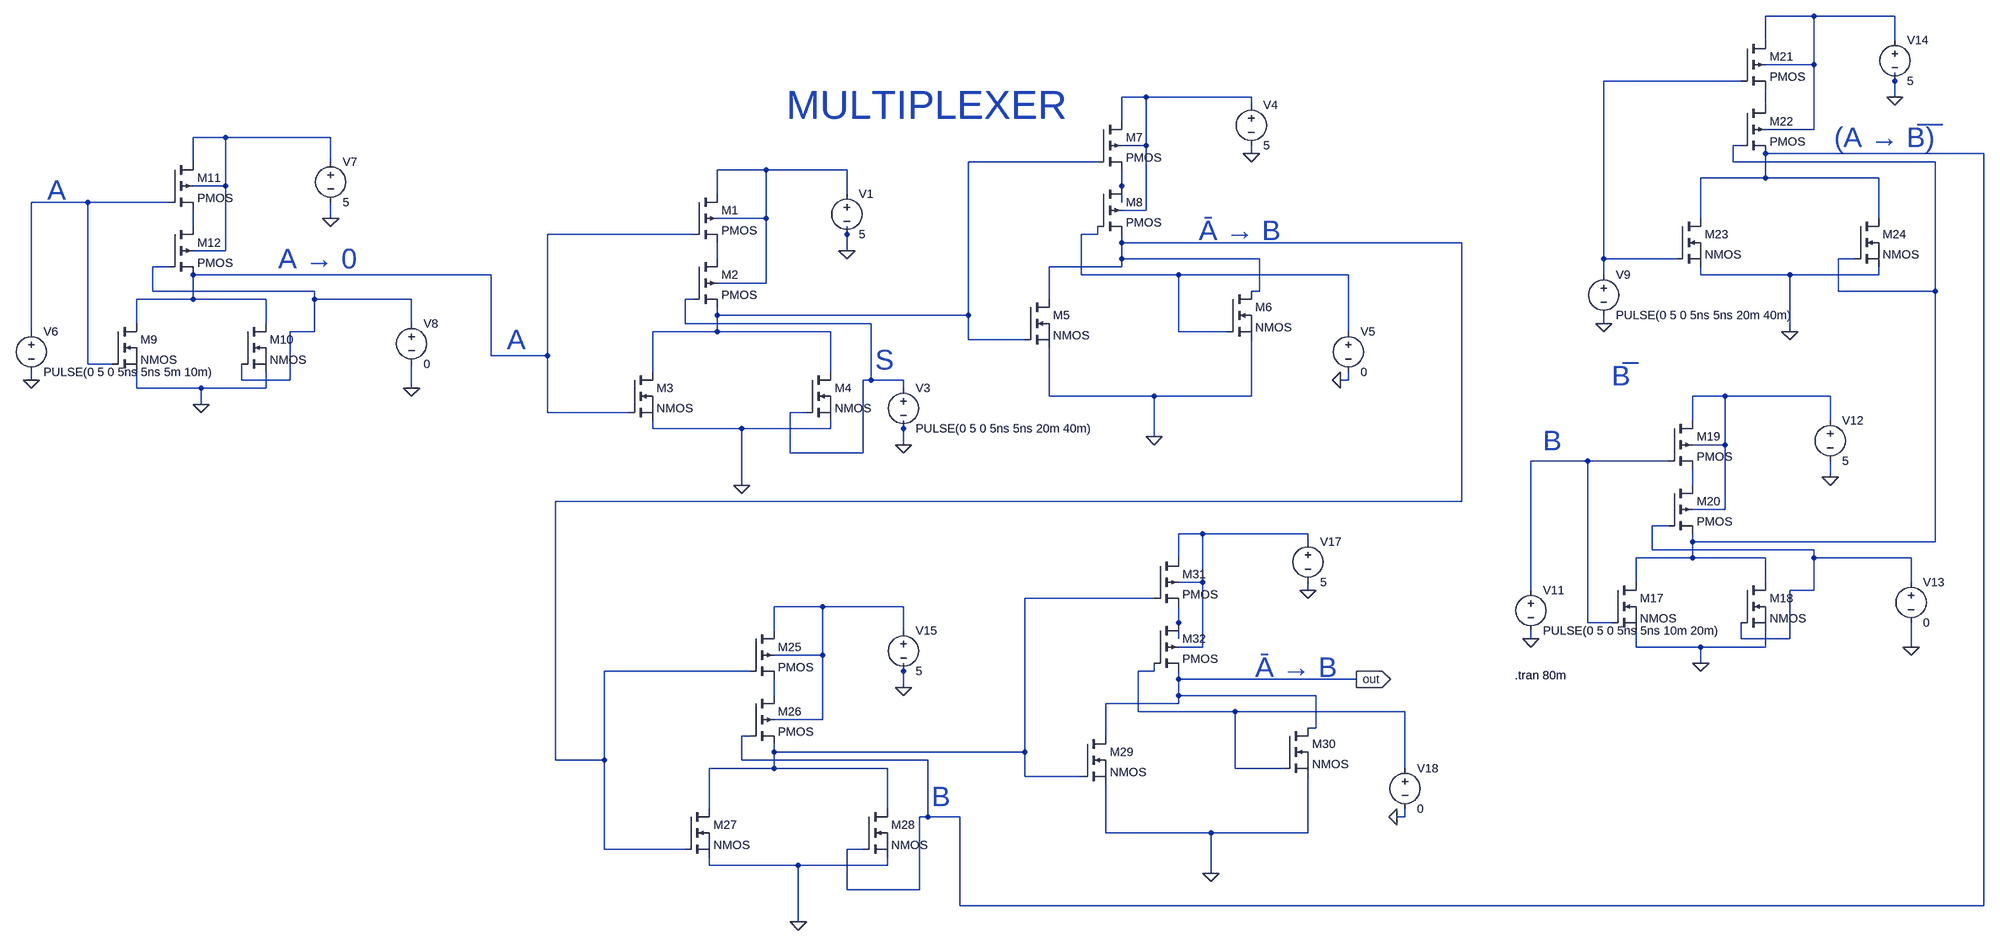
[diagram p0: schematic originalmuximply.asc]
originalmuximply.asc, the LTspice schematic file:
Version 4
SHEET 1 4408 2020
WIRE 3584 -352 3488 -352
WIRE 3744 -352 3584 -352
WIRE 3488 -304 3488 -352
WIRE 3744 -304 3744 -352
WIRE 3584 -256 3584 -352
WIRE 3584 -256 3488 -256
WIRE 3440 -224 3168 -224
WIRE 3744 -224 3744 -240
WIRE 2208 -192 2160 -192
WIRE 2416 -192 2208 -192
WIRE 3744 -192 3744 -224
WIRE 2416 -176 2416 -192
WIRE 3488 -176 3488 -208
WIRE 2160 -144 2160 -192
WIRE 3584 -128 3584 -256
WIRE 3584 -128 3488 -128
WIRE 352 -112 288 -112
WIRE 560 -112 352 -112
WIRE 2208 -96 2208 -192
WIRE 2208 -96 2160 -96
WIRE 3440 -96 3424 -96
WIRE 2416 -80 2416 -96
WIRE 3920 -80 3488 -80
WIRE 288 -64 288 -112
WIRE 560 -64 560 -112
WIRE 2112 -64 1856 -64
WIRE 3424 -64 3424 -96
WIRE 3824 -64 3424 -64
WIRE 1456 -48 1360 -48
WIRE 1616 -48 1456 -48
WIRE 3488 -32 3488 -80
WIRE 3488 -32 3360 -32
WIRE 3712 -32 3488 -32
WIRE 352 -16 352 -112
WIRE 352 -16 288 -16
WIRE 2160 -16 2160 -48
WIRE 1360 0 1360 -48
WIRE 1616 0 1616 -48
WIRE 80 16 -32 16
WIRE 240 16 80 16
WIRE 2160 16 2160 -16
WIRE 2208 32 2208 -96
WIRE 2208 32 2160 32
WIRE 560 48 560 16
WIRE 1456 48 1456 -48
WIRE 1456 48 1360 48
WIRE 3360 48 3360 -32
WIRE 3712 48 3712 -32
WIRE 288 64 288 32
WIRE 1312 80 1024 80
WIRE 1616 80 1616 64
WIRE 2112 80 2112 64
WIRE 2112 80 2080 80
WIRE 2160 96 2160 80
WIRE 2832 96 2160 96
WIRE 352 112 352 -16
WIRE 352 112 288 112
WIRE 1616 112 1616 80
WIRE 1360 128 1360 96
WIRE 2160 128 2160 96
WIRE 2432 128 2160 128
WIRE 3168 128 3168 -224
WIRE 3312 128 3168 128
WIRE 3664 128 3632 128
WIRE 240 144 208 144
WIRE 2160 144 2160 128
WIRE 2160 144 2016 144
WIRE 912 160 288 160
WIRE 2080 160 2080 80
WIRE 2272 160 2080 160
WIRE 2608 160 2272 160
WIRE 3168 160 3168 128
WIRE 3360 160 3360 144
WIRE 3536 160 3360 160
WIRE 3712 160 3712 144
WIRE 3712 160 3536 160
WIRE 1456 176 1456 48
WIRE 1456 176 1360 176
WIRE 208 192 208 144
WIRE 528 192 208 192
WIRE 2432 192 2432 128
WIRE 2432 192 2416 192
WIRE 3632 192 3632 128
WIRE 3824 192 3824 -64
WIRE 3824 192 3632 192
WIRE 288 208 288 160
WIRE 288 208 176 208
WIRE 432 208 288 208
WIRE 528 208 528 192
WIRE 720 208 528 208
WIRE 1312 208 1296 208
WIRE 2016 208 2016 144
WIRE 1360 240 1360 224
WIRE 1856 240 1856 -64
WIRE 1856 240 1360 240
WIRE 176 256 176 208
WIRE 432 256 432 208
WIRE 720 256 720 208
WIRE 1296 256 1296 208
WIRE 1664 256 1296 256
WIRE 3168 256 3168 240
WIRE -32 272 -32 16
WIRE 528 272 528 208
WIRE 528 272 480 272
WIRE 1360 272 1360 240
WIRE 1360 272 1232 272
WIRE 1584 272 1360 272
WIRE 2272 272 2272 160
WIRE 2368 272 2272 272
WIRE 2608 272 2608 160
WIRE 3536 272 3536 160
WIRE 1856 288 1856 240
WIRE 1968 288 1856 288
WIRE 912 320 912 160
WIRE 1024 320 1024 80
WIRE 1024 320 912 320
WIRE 80 336 80 16
WIRE 128 336 80 336
WIRE 1232 352 1232 272
WIRE 1584 352 1584 272
WIRE -32 368 -32 352
WIRE 384 368 384 336
WIRE 480 368 480 272
WIRE 480 368 384 368
WIRE 1664 368 1664 256
WIRE 1664 368 1648 368
WIRE 1728 368 1664 368
WIRE 2608 368 2608 352
WIRE 2608 368 2592 368
WIRE 176 384 176 352
WIRE 304 384 176 384
WIRE 432 384 432 352
WIRE 432 384 304 384
WIRE 720 384 720 336
WIRE 1728 384 1728 368
WIRE 2016 400 2016 304
WIRE 2224 400 2016 400
WIRE 2416 400 2416 288
WIRE 2416 400 2224 400
WIRE 3408 400 3344 400
WIRE 3616 400 3408 400
WIRE 304 416 304 384
WIRE 1024 432 1024 320
WIRE 1184 432 1024 432
WIRE 1536 432 1504 432
WIRE 3344 448 3344 400
WIRE 3616 448 3616 400
WIRE 1232 464 1232 448
WIRE 1408 464 1232 464
WIRE 1584 464 1584 448
WIRE 1584 464 1408 464
WIRE 1728 464 1728 448
WIRE 2224 480 2224 400
WIRE 1728 496 1728 464
WIRE 3408 496 3408 400
WIRE 3408 496 3344 496
WIRE 1504 512 1504 432
WIRE 1648 512 1648 368
WIRE 1648 512 1504 512
WIRE 3136 528 3024 528
WIRE 3296 528 3136 528
WIRE 3616 560 3616 528
WIRE 1408 576 1408 464
WIRE 3344 576 3344 544
WIRE 2832 608 2832 96
WIRE 2832 608 1040 608
WIRE 3408 624 3408 496
WIRE 3408 624 3344 624
WIRE 3296 656 3264 656
WIRE 2320 672 2272 672
WIRE 2528 672 2320 672
WIRE 2528 688 2528 672
WIRE 3344 688 3344 672
WIRE 3824 688 3824 192
WIRE 3824 688 3344 688
WIRE 3264 704 3264 656
WIRE 3584 704 3264 704
WIRE 2272 720 2272 672
WIRE 3344 720 3344 688
WIRE 3344 720 3232 720
WIRE 3488 720 3344 720
WIRE 3584 720 3584 704
WIRE 3776 720 3584 720
WIRE 2320 768 2320 672
WIRE 2320 768 2272 768
WIRE 3232 768 3232 720
WIRE 3488 768 3488 720
WIRE 3776 768 3776 720
WIRE 2528 784 2528 768
WIRE 3024 784 3024 528
WIRE 3584 784 3584 720
WIRE 3584 784 3536 784
WIRE 2224 800 1968 800
WIRE 1568 816 1472 816
WIRE 1728 816 1568 816
WIRE 2272 848 2272 816
WIRE 3136 848 3136 528
WIRE 3184 848 3136 848
WIRE 1472 864 1472 816
WIRE 1728 864 1728 816
WIRE 2272 880 2272 848
WIRE 3024 880 3024 864
WIRE 3440 880 3440 848
WIRE 3536 880 3536 784
WIRE 3536 880 3440 880
WIRE 2320 896 2320 768
WIRE 2320 896 2272 896
WIRE 3232 896 3232 864
WIRE 3360 896 3232 896
WIRE 3488 896 3488 864
WIRE 3488 896 3360 896
WIRE 3776 896 3776 848
WIRE 1568 912 1568 816
WIRE 1568 912 1472 912
WIRE 3360 928 3360 896
WIRE 1424 944 1136 944
WIRE 1728 944 1728 928
WIRE 2224 944 2224 928
WIRE 2224 944 2192 944
WIRE 2272 960 2272 944
WIRE 2624 960 2272 960
WIRE 1728 976 1728 944
WIRE 1472 992 1472 960
WIRE 2272 992 2272 960
WIRE 2544 992 2272 992
WIRE 2272 1008 2272 992
WIRE 2272 1008 2128 1008
WIRE 2192 1024 2192 944
WIRE 2384 1024 2192 1024
WIRE 2720 1024 2384 1024
WIRE 1568 1040 1568 912
WIRE 1568 1040 1472 1040
WIRE 2544 1056 2544 992
WIRE 2544 1056 2528 1056
WIRE 1424 1072 1408 1072
WIRE 2128 1072 2128 1008
WIRE 1472 1104 1472 1088
WIRE 1968 1104 1968 800
WIRE 1968 1104 1472 1104
WIRE 1040 1120 1040 608
WIRE 1136 1120 1136 944
WIRE 1136 1120 1040 1120
WIRE 1408 1120 1408 1072
WIRE 1776 1120 1408 1120
WIRE 1472 1136 1472 1104
WIRE 1472 1136 1344 1136
WIRE 1696 1136 1472 1136
WIRE 2384 1136 2384 1024
WIRE 2480 1136 2384 1136
WIRE 2720 1136 2720 1024
WIRE 1968 1152 1968 1104
WIRE 2080 1152 1968 1152
WIRE 1344 1216 1344 1136
WIRE 1696 1216 1696 1136
WIRE 1776 1232 1776 1120
WIRE 1776 1232 1760 1232
WIRE 1840 1232 1776 1232
WIRE 2720 1232 2720 1216
WIRE 2720 1232 2704 1232
WIRE 2128 1264 2128 1168
WIRE 2336 1264 2128 1264
WIRE 2528 1264 2528 1152
WIRE 2528 1264 2336 1264
WIRE 1136 1296 1136 1120
WIRE 1296 1296 1136 1296
WIRE 1648 1296 1616 1296
WIRE 1344 1328 1344 1312
WIRE 1520 1328 1344 1328
WIRE 1696 1328 1696 1312
WIRE 1696 1328 1520 1328
WIRE 2336 1344 2336 1264
WIRE 1616 1376 1616 1296
WIRE 1760 1376 1760 1232
WIRE 1760 1376 1616 1376
WIRE 1840 1408 1840 1232
WIRE 3920 1408 3920 -80
WIRE 3920 1408 1840 1408
WIRE 1520 1440 1520 1328
FLAG 3536 272 0
FLAG 3744 -192 0
FLAG 3168 256 0
FLAG 3616 560 0
FLAG 3360 928 0
FLAG 3024 880 0
FLAG 3776 896 0
FLAG 1408 576 0
FLAG 1616 112 0
FLAG 1728 496 0
FLAG 2416 -80 0
FLAG 2224 480 0
FLAG 2592 368 0
FLAG 560 48 0
FLAG 304 416 0
FLAG -32 368 0
FLAG 720 384 0
FLAG 1520 1440 0
FLAG 1728 976 0
FLAG 2528 784 0
FLAG 2336 1344 0
FLAG 2704 1232 0
FLAG 2624 960 out
IOPIN 2624 960 Out
SYMBOL pmos4 3440 -304 R0
SYMATTR InstName M21
SYMBOL pmos4 3440 -176 R0
SYMATTR InstName M22
SYMBOL nmos 3312 48 R0
SYMATTR InstName M23
SYMBOL nmos 3664 48 R0
SYMATTR InstName M24
SYMBOL voltage 3744 -320 R0
WINDOW 123 0 0 Left 0
WINDOW 39 0 0 Left 0
SYMATTR InstName V14
SYMATTR Value 5
SYMBOL voltage 3168 144 R0
WINDOW 123 0 0 Left 0
WINDOW 39 0 0 Left 0
SYMATTR InstName V9
SYMATTR Value PULSE(0 5 0 5ns 5ns 20m 40m)
SYMBOL nmos 3184 768 R0
SYMATTR InstName M17
SYMBOL voltage 3024 768 R0
WINDOW 123 0 0 Left 0
WINDOW 39 0 0 Left 0
SYMATTR InstName V11
SYMATTR Value PULSE(0 5 0 5ns 5ns 10m 20m)
SYMBOL voltage 3616 432 R0
WINDOW 123 0 0 Left 0
WINDOW 39 0 0 Left 0
SYMATTR InstName V12
SYMATTR Value 5
SYMBOL voltage 3776 752 R0
WINDOW 123 0 0 Left 0
WINDOW 39 0 0 Left 0
SYMATTR InstName V13
SYMATTR Value 0
SYMBOL nmos 3440 768 R0
SYMATTR InstName M18
SYMBOL pmos4 3296 448 R0
SYMATTR InstName M19
SYMBOL pmos4 3296 576 R0
SYMATTR InstName M20
SYMBOL pmos4 1312 0 R0
SYMATTR InstName M1
SYMBOL pmos4 1312 128 R0
SYMATTR InstName M2
SYMBOL nmos 1184 352 R0
SYMATTR InstName M3
SYMBOL nmos 1536 352 R0
SYMATTR InstName M4
SYMBOL voltage 1616 -16 R0
WINDOW 123 0 0 Left 0
WINDOW 39 0 0 Left 0
SYMATTR InstName V1
SYMATTR Value 5
SYMBOL voltage 1728 368 R0
WINDOW 123 0 0 Left 0
WINDOW 39 0 0 Left 0
SYMATTR InstName V3
SYMATTR Value PULSE(0 5 0 5ns 5ns 20m 40m)
SYMBOL nmos 1968 208 R0
SYMATTR InstName M5
SYMBOL nmos 2368 192 R0
SYMATTR InstName M6
SYMBOL voltage 2416 -192 R0
WINDOW 123 0 0 Left 0
WINDOW 39 0 0 Left 0
SYMATTR InstName V4
SYMATTR Value 5
SYMBOL voltage 2608 256 R0
WINDOW 123 0 0 Left 0
WINDOW 39 0 0 Left 0
SYMATTR InstName V5
SYMATTR Value 0
SYMBOL pmos4 2112 -144 R0
SYMATTR InstName M7
SYMBOL pmos4 2112 -16 R0
SYMATTR InstName M8
SYMBOL nmos 128 256 R0
SYMATTR InstName M9
SYMBOL voltage -32 256 R0
WINDOW 123 0 0 Left 0
WINDOW 39 0 0 Left 0
SYMATTR InstName V6
SYMATTR Value PULSE(0 5 0 5ns 5ns 5m 10m)
SYMBOL voltage 560 -80 R0
WINDOW 123 0 0 Left 0
WINDOW 39 0 0 Left 0
SYMATTR InstName V7
SYMATTR Value 5
SYMBOL voltage 720 240 R0
WINDOW 123 0 0 Left 0
WINDOW 39 0 0 Left 0
SYMATTR InstName V8
SYMATTR Value 0
SYMBOL nmos 384 256 R0
SYMATTR InstName M10
SYMBOL pmos4 240 -64 R0
SYMATTR InstName M11
SYMBOL pmos4 240 64 R0
SYMATTR InstName M12
SYMBOL pmos4 1424 864 R0
SYMATTR InstName M25
SYMBOL pmos4 1424 992 R0
SYMATTR InstName M26
SYMBOL nmos 1296 1216 R0
SYMATTR InstName M27
SYMBOL nmos 1648 1216 R0
SYMATTR InstName M28
SYMBOL voltage 1728 848 R0
WINDOW 123 0 0 Left 0
WINDOW 39 0 0 Left 0
SYMATTR InstName V15
SYMATTR Value 5
SYMBOL nmos 2080 1072 R0
SYMATTR InstName M29
SYMBOL nmos 2480 1056 R0
SYMATTR InstName M30
SYMBOL voltage 2528 672 R0
WINDOW 123 0 0 Left 0
WINDOW 39 0 0 Left 0
SYMATTR InstName V17
SYMATTR Value 5
SYMBOL voltage 2720 1120 R0
WINDOW 123 0 0 Left 0
WINDOW 39 0 0 Left 0
SYMATTR InstName V18
SYMATTR Value 0
SYMBOL pmos4 2224 720 R0
SYMATTR InstName M31
SYMBOL pmos4 2224 848 R0
SYMATTR InstName M32
TEXT 3184 360 Left 5 ;B̅
TEXT 3624 -112 Left 5 ;(A → B̅)̅
TEXT 2992 952 Left 2 !.tran 80m
TEXT 3048 488 Left 5 ;B
TEXT 944 288 Left 5 ;A
TEXT 1672 328 Left 5 ;S
TEXT 2312 72 Left 5 ;Ā → B
TEXT 0 -8 Left 5 ;A
TEXT 456 128 Left 5 ;A → 0
TEXT 1784 1192 Left 5 ;B
TEXT 2424 936 Left 5 ;Ā → B
TEXT 1496 -176 Left 6 ;MULTIPLEXER

The netlist it stands for:
* originalmuximply.asc
M21 N001 N002 N004 N001 PMOS
M22 N004 N006 N007 N001 PMOS
M23 N007 N002 0 0 NMOS
M24 N007 N006 0 0 NMOS
V14 N001 0 5
V9 N002 0 PULSE(0 5 0 5ns 5ns 20m 40m)
M17 N006 N020 0 0 NMOS
V11 N020 0 PULSE(0 5 0 5ns 5ns 10m 20m)
V12 N019 0 5
V13 N022 0 0
M18 N006 N022 0 0 NMOS
M19 N019 N020 N021 N019 PMOS
M20 N021 N022 N006 N019 PMOS
M1 N009 N013 N016 N009 PMOS
M2 N016 N018 N008 N009 PMOS
M3 N008 N013 0 0 NMOS
M4 N008 N018 0 0 NMOS
V1 N009 0 5
V3 N018 0 PULSE(0 5 0 5ns 5ns 20m 40m)
M5 N015 N008 0 0 NMOS
M6 N015 N014 0 0 NMOS
V4 N003 0 5
V5 N014 0 0
M7 N003 N008 N010 N003 PMOS
M8 N010 N014 N015 N003 PMOS
M9 N013 N011 0 0 NMOS
V6 N011 0 PULSE(0 5 0 5ns 5ns 5m 10m)
V7 N005 0 5
V8 N017 0 0
M10 N013 N017 0 0 NMOS
M11 N005 N011 N012 N005 PMOS
M12 N012 N017 N013 N005 PMOS
M25 N025 N015 N028 N025 PMOS
M26 N028 N007 N024 N025 PMOS
M27 N024 N015 0 0 NMOS
M28 N024 N007 0 0 NMOS
V15 N025 0 5
M29 out N024 0 0 NMOS
M30 out N027 0 0 NMOS
V17 N023 0 5
V18 N027 0 0
M31 N023 N024 N026 N023 PMOS
M32 N026 N027 out N023 PMOS
.model NMOS NMOS
.model PMOS PMOS
.lib standard.mos
* B̅
* (A → B̅)̅
.tran 80m
* B
* A
* S
* Ā → B
* A
* A → 0
* B
* Ā → B
* MULTIPLEXER
.backanno
.end